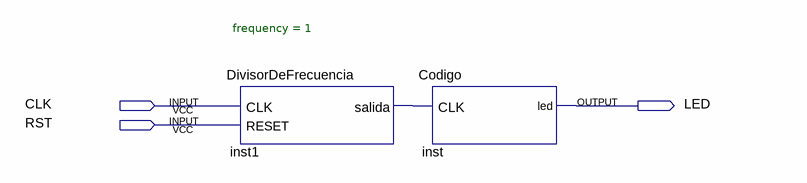
[diagram p0: schematic sheet]
// Quartus schematic Pruebas.bdf as structural Verilog: 2 symbols, 3 pins
module Pruebas (
  input  CLK,
  input  RST,
  output LED
);

  wire inst1_salida;

  DivisorDeFrecuencia #(.frequency(1)) inst1 (.CLK(CLK), .RESET(RST), .salida(inst1_salida));
  Codigo inst (.CLK(inst1_salida), .led(LED));
endmodule
